# Altium project RC-XD(RX).PrjPcb
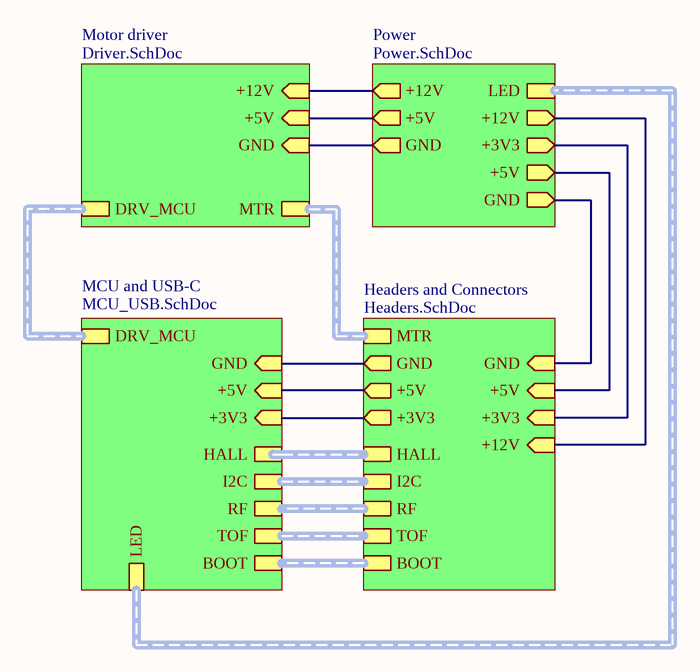
[diagram p0: Overview.SchDoc]
GlobalAddress: Tallinn; GlobalAddress2: Harju maakond; GlobalProjectRevision: v1; GlobalProjectTitle: RC-XD; GlobalProjectTitleAbr: RX_PCB; GlobalRevisionDate: 2026-1-14; GlobalRevisionEngineer: Robin Madar
3 sheets, 38 parts. Net scope: hierarchical (ports join the sheet entries above them; power ports are global).
Board file: RX.PcbDoc
Sheets:
  Overview.SchDoc
    Motor driver = Driver.SchDoc
    MCU and USB-C = MCU_USB.SchDoc

## Sheet Overview.SchDoc
size 297 x 209 mm; SheetNumber: 1; SheetTotal: 5

### Sub-sheets
Headers and Connectors = Headers.SchDoc (file not in this document): +3V3 (in), GND (in), +5V (in), MTR, +3V3 (out), +5V (out), GND (out), HALL, I2C, RF, TOF, BOOT, +12V (in)
MCU and USB-C = MCU_USB.SchDoc: +3V3 (in), GND (in), +5V (in), DRV_MCU, HALL, I2C, RF, TOF, BOOT, LED
Motor driver = Driver.SchDoc: +12V (in), +5V (in), GND (in), MTR, DRV_MCU
Power = Power.SchDoc (file not in this document): +12V (out), +3V3 (out), GND (out), GND (out), +5V (out), +5V (out), LED, +12V (out)

### Nets
(unnamed): sheet Motor driver/+12V, sheet Power/+12V
(unnamed): sheet Motor driver/+5V, sheet Power/+5V
(unnamed): sheet Motor driver/GND, sheet Power/GND
(unnamed): sheet Power/+3V3, sheet Headers and Connectors/+3V3
(unnamed): sheet Power/GND, sheet Headers and Connectors/GND
(unnamed): sheet Power/+5V, sheet Headers and Connectors/+5V
(unnamed): sheet Power/+12V, sheet Headers and Connectors/+12V
(unnamed): sheet MCU and USB-C/+3V3, sheet Headers and Connectors/+3V3
(unnamed): sheet MCU and USB-C/GND, sheet Headers and Connectors/GND
(unnamed): sheet MCU and USB-C/+5V, sheet Headers and Connectors/+5V

### Buses and harness runs
harness sheet Headers and Connectors/BOOT = sheet MCU and USB-C/BOOT
harness sheet Headers and Connectors/HALL = sheet MCU and USB-C/HALL
harness sheet Headers and Connectors/I2C = sheet MCU and USB-C/I2C
harness sheet Headers and Connectors/MTR = sheet Motor driver/MTR
harness sheet Headers and Connectors/RF = sheet MCU and USB-C/RF
harness sheet Headers and Connectors/TOF = sheet MCU and USB-C/TOF
harness sheet MCU and USB-C/DRV_MCU = sheet Motor driver/DRV_MCU
harness sheet MCU and USB-C/LED = sheet Power/LED

### Notes on the sheet
- THIS DOCUMENT AND THE DATA DISCLOSED HEREIN OR
- HEREWITH IS THE PROPERTY OF ALTIUM LIMITED AND MAY
- DWG NO:
- REVISION
- REV:
- DESCRIPTION
- DATE
- APPROVED
- BE FREELY DISTRIBUTED IN WHOLE. NO RIGHTS ARE
- RESERVED OR EXPRESS OR IMPLIED WARANTEE GIVEN.
- ENG:
- APPROVALS
- PROJECT
- DSN:
- CHK:
- REFERENCE DOCUMENTS
- PROJECT REVISION:
- TITLE
- DOCUMENT REVISION:
- DESIGN ITEM:
- BOM:
- FAB DWG:
- PCB DWG:
- ASSY DWG:
- SCALE:
- A3
- SIZE
- CAGE CODE
- FILE NAME
- DWG NO.
- SHEET
- OF
- REV

## Sheet Driver.SchDoc
size 297 x 209 mm; ENG_APP_DATE: --/--/--; DSN_APP_DATE: --/--/--; CHK_APP_DATE: --/--/--; SheetNumber: 2; SheetTotal: 5
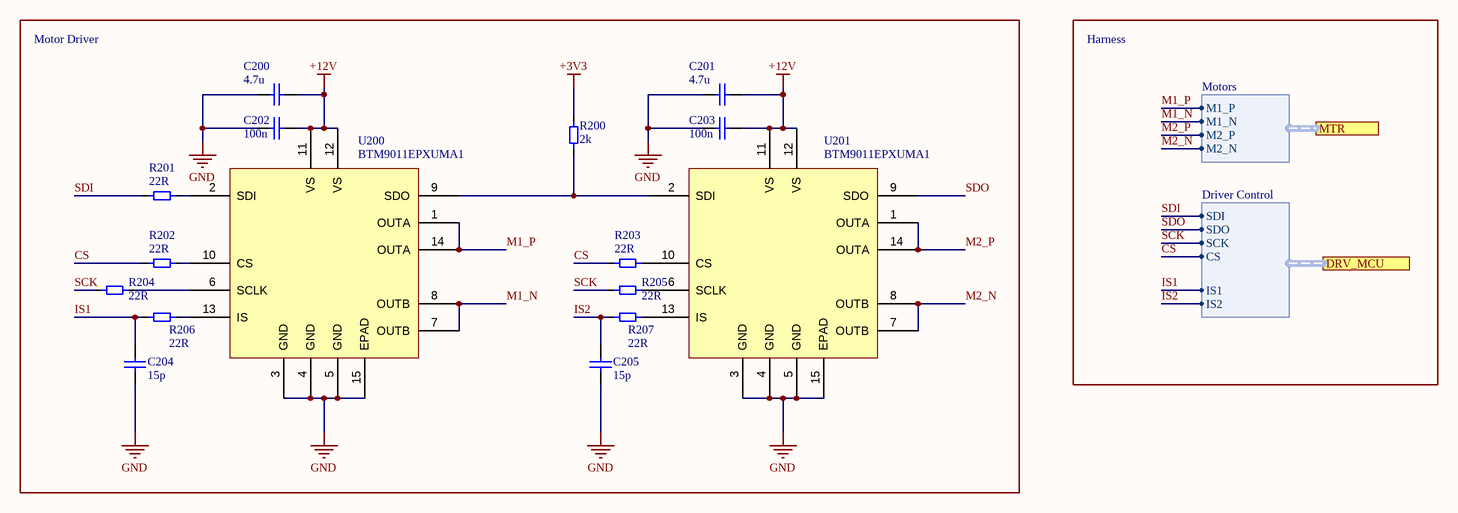
[diagram p1: Driver.SchDoc]

### Parts
C200  4.7u  [MLCC_0603_M]
C201  4.7u  [MLCC_0603_M]
C202  100n  [MLCC_0603_M]
C203  100n  [MLCC_0603_M]
C204  15p  [MLCC_0603_M]
C205  15p  [MLCC_0603_M]
R200  2k  [Resistor_0603_M]
R201  22R  [Resistor_0603_M]
R202  22R  [Resistor_0603_M]
R203  22R  [Resistor_0603_M]
R204  22R  [Resistor_0603_M]
R205  22R  [Resistor_0603_M]
R206  22R  [Resistor_0603_M]
R207  22R  [Resistor_0603_M]
U200  BTM9011EPXUMA1  [BTM9011EPXUMA1]
U201  BTM9011EPXUMA1  [BTM9011EPXUMA1]

### Blocks framed on the sheet
Motor Driver: C200-C205 R200-R207 U200 U201

### Ports
DRV_MCU (harness Driver Control, see Overview[3B], MCU_USB[2A]), MTR (harness Motors, see Overview[3B], Headers[2A])

### Harnesses
Motors: M1_P, M1_N, M2_P, M2_N
Driver Control: SCK, SDO, IS1, SDI, IS2, CS

### Nets
+3V3: R200.2
+12V: C200.2 C201.2 C202.2 C203.2 U200.11(VS) U200.12(VS) U201.11(VS) U201.12(VS)
GND: C200.1 C201.1 C202.1 C203.1 C204.2 C205.2 U200.3(GND) U200.4(GND) U200.5(GND) U200.15(EPAD) U201.3(GND) U201.4(GND) U201.5(GND) U201.15(EPAD)
CS: R202.1 R203.1 ; port DRV_MCU.CS
IS1: C204.1 R206.1 ; port DRV_MCU.IS1
IS2: C205.1 R207.1 ; port DRV_MCU.IS2
M1_N: U200.7(OUTB) U200.8(OUTB) ; port MTR.M1_N
M1_P: U200.1(OUTA) U200.14(OUTA) ; port MTR.M1_P
M2_N: U201.7(OUTB) U201.8(OUTB) ; port MTR.M2_N
M2_P: U201.1(OUTA) U201.14(OUTA) ; port MTR.M2_P
SCK: R204.1 R205.1 ; port DRV_MCU.SCK
SDI: R201.1 ; port DRV_MCU.SDI
SDO: U201.9(SDO) ; port DRV_MCU.SDO
NetR200_1: R200.1 U200.9(SDO) U201.2(SDI)
NetR201_2: R201.2 U200.2(SDI)
NetR202_2: R202.2 U200.10(CS)
NetR203_2: R203.2 U201.10(CS)
NetR204_2: R204.2 U200.6(SCLK)
NetR205_2: R205.2 U201.6(SCLK)
NetR206_2: R206.2 U200.13(IS)
NetR207_2: R207.2 U201.13(IS)

### Notes on the sheet
- Harness
- THIS DOCUMENT AND THE DATA DISCLOSED HEREIN OR
- HEREWITH IS THE PROPERTY OF ALTIUM LIMITED AND MAY
- DWG NO:
- REVISION
- REV:
- DESCRIPTION
- DATE
- APPROVED
- BE FREELY DISTRIBUTED IN WHOLE. NO RIGHTS ARE
- RESERVED OR EXPRESS OR IMPLIED WARANTEE GIVEN.
- ENG:
- APPROVALS
- PROJECT
- DSN:
- CHK:
- REFERENCE DOCUMENTS
- PROJECT REVISION:
- TITLE
- DOCUMENT REVISION:
- DESIGN ITEM:
- BOM:
- FAB DWG:
- PCB DWG:
- ASSY DWG:
- SCALE:
- A3
- SIZE
- CAGE CODE
- FILE NAME
- DWG NO.
- SHEET
- OF
- REV

### Library data of the parts
C200 C201 = CMP-001-1257-1: MLCC, 0603, 4.7u, 10%, 35V, X5R; Manufacturer: Any; Value: 4,7µF; Capacitor Type: Ceramic; Dielectric: X5R; Tolerance: 10%; Voltage: 35V; Part number: MLCC, 0603, 4.7u, 10%, 35V, X5R; Case/Package: 0603; Mount: SMD; RoHS: Yes
C202 C203 = CMP-001-0755-1: MLCC, 0603, 100n, 10%, 35V, X7R; Manufacturer: Any; Capacitor Type: Ceramic; Value: 100nF; Voltage: 35V; Case/Package: 0603; Part number: MLCC, 0603, 100n, 10%, 35V, X7R; RoHS: Yes; Tolerance: 10%; Dielectric: X7R; Mount: SMD
C204 C205 = CMP-001-0474-1: MLCC, 0603, 15p, 5%, 50V, C0G/NP0; Manufacturer: Any; Value: 15pF; Capacitor Type: Ceramic; Dielectric: C0G/NP0; Case/Package: 0603; Part number: MLCC, 0603, 15p, 5%, 50V, C0G/NP0; Voltage: 50V; Mount: SMD; RoHS: Yes; Tolerance: 5%
R200 = CMP-001-0084-2: Resistor, 0603, 2k, 1%, 1/10W; Manufacturer: Any; Power: 100mW; Mount: SMD; Value: 2k; RoHS: Yes; Case/Package: 0603; Part number: Resistor, 0603, 2k, 1%, 1/10W; Tolerance: 1%
R201-R207 = CMP-001-0038-3: Resistor, 0603, 22R, 1%, 1/10W; Manufacturer: Any; Value: 22; Power: 100mW; Part number: Resistor, 0603, 22R, 1%, 1/10W; Tolerance: 1%; Case/Package: 0603; Mount: SMD; RoHS: Yes
U200 U201 = CMP-00022-3: DC Mtr Drive, Brush, 150DEGC, TSSOPEP-14 Rohs Compliant: Yes; Manufacturer: Infineon Technologies; Current - Output: 9.2A; Voltage - Supply: 4.5V ~ 40V; Interface: SPI; Output configuration: Full bridge; Motor Type - AC, DC: Brushed DC; REACH SVHC: Yes; RoHS: Compliant; Voltage - Load: 4.5V ~ 40V; Operating Temperature: -40C ~ 150C; Case/Package: 14-TSSOP; Mount: SMD; Part number: BTM9011EPXUMA1

## Sheet MCU_USB.SchDoc
size 297 x 209 mm; SheetNumber: 4; SheetTotal: 5
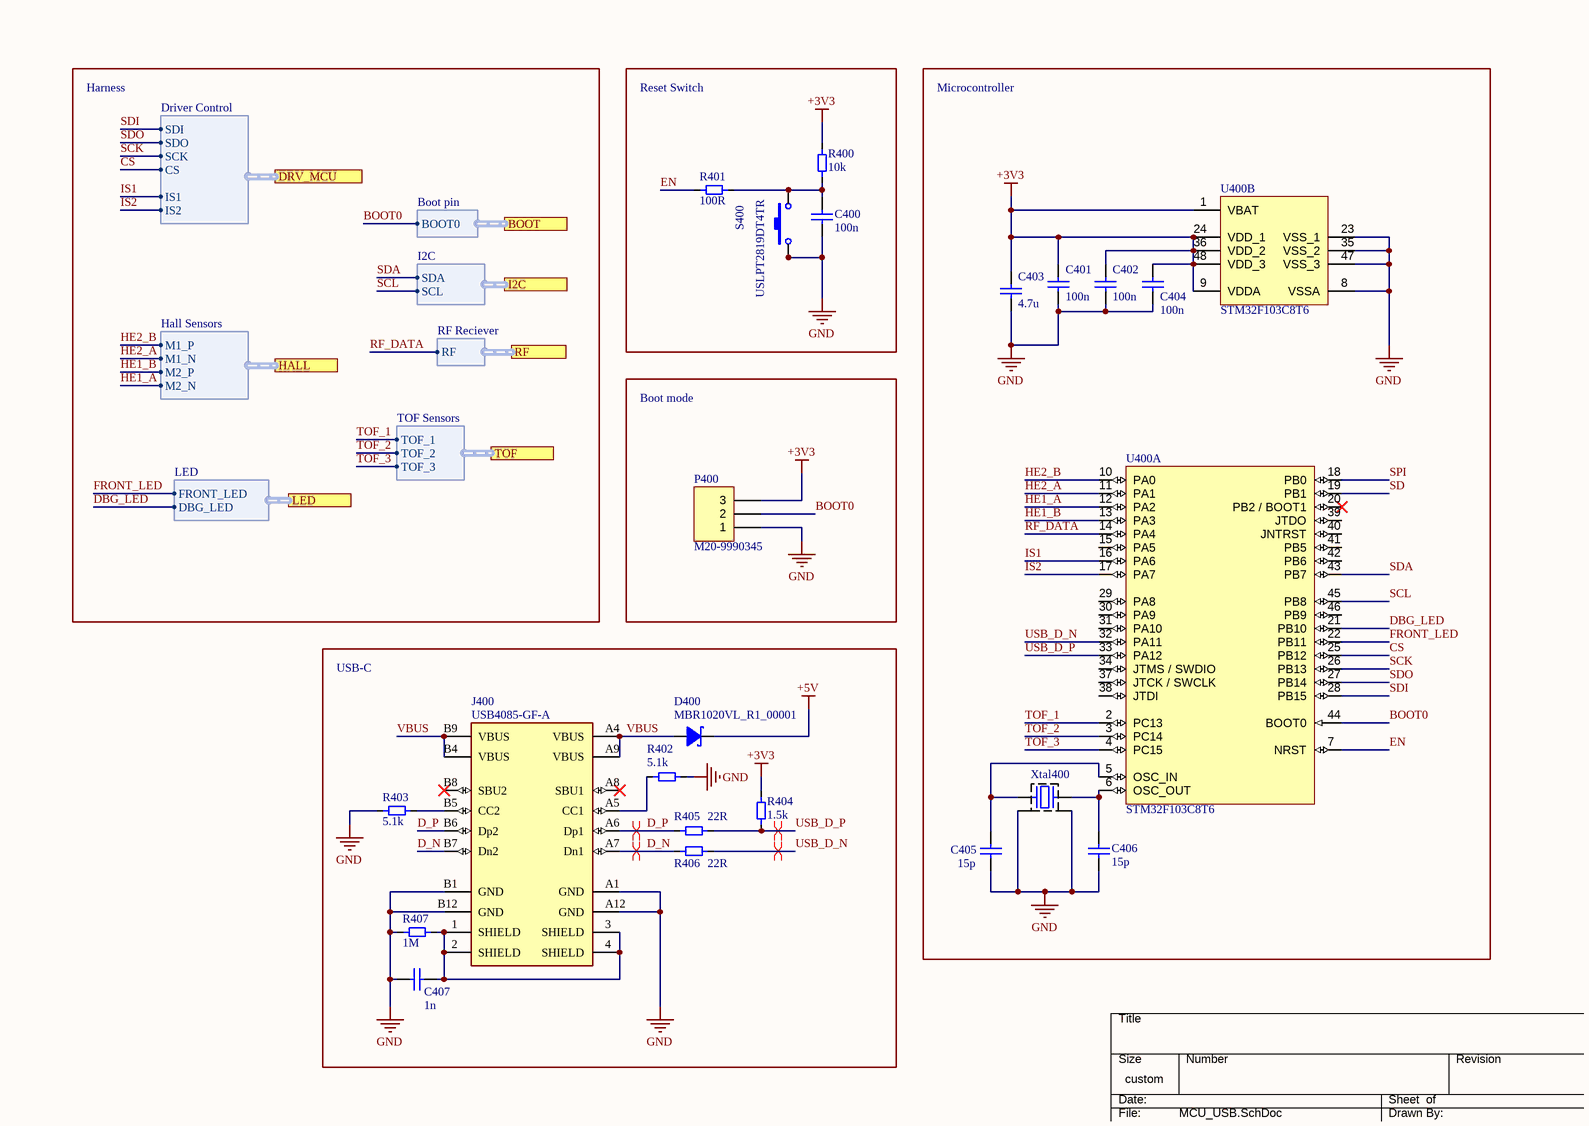
[diagram p2: MCU_USB.SchDoc]

### Parts
C400  100n  [MLCC_0603_M]
C401  100n  [MLCC_0603_M]
C402  100n  [MLCC_0603_M]
C403  4.7u  [MLCC_0805_M]
C404  100n  [MLCC_0603_M]
C405  15p  [MLCC_0402_M]
C406  15p  [MLCC_0402_M]
C407  1n  [MLCC_0603_M]
D400  MBR1020VL_R1_00001  [FP-MBR1020VL_R1_00001-MFG]
J400  USB4085-GF-A  [FP-USB4085-GF-A-MFG]
P400  M20-9990345  [3Pos Pin Header]
R400  10k  [Resistor_0603_M]
R401  100R  [Resistor_0603_M]
R402  5.1k  [Resistor_0603_M]
R403  5.1k  [Resistor_0603_M]
R404  1.5k  [Resistor_0603_M]
R405  22R  [Resistor_0603_M]
R406  22R  [Resistor_0603_M]
R407  1M  [Resistor_1206_M]
S400  USLPT2819DT4TR  [USLPT2819DT4TR-Footprint-1]
U400  STM32F103C8T6  [STM-LQFP48_M]  (parts A,B of 2)
Xtal400  ABM11-16.000MHZ-12-N1G-T  [FP-ABM11-MFG]  (value not drawn)

### Blocks framed on the sheet
Reset Switch: C400 R400 R401 S400
Microcontroller: C401-C406 U400 Xtal400
Boot mode: P400
USB-C: C407 D400 J400 R402-R407

### Ports
BOOT (harness Boot pin, see Overview[3C], Headers[4A]), DRV_MCU (harness Driver Control, see Overview[3B], Driver[6B]), HALL (harness Hall Sensors, see Overview[3C], Headers[2A]), I2C (harness I2C, see Overview[3C], Headers[3A]), LED (harness LED, see Overview[3C], Power[2A]), RF (harness RF Reciever, see Overview[3C], Headers[4A]), TOF (harness TOF Sensors, see Overview[3C], Headers[3A])

### Harnesses
Driver Control: SCK, SDO, IS1, SDI, IS2, CS
Hall Sensors: M1_P, M1_N, M2_P, M2_N
LED: FRONT_LED, DBG_LED
Boot pin: BOOT0
I2C: SDA, SCL
TOF Sensors: TOF_1, TOF_2, TOF_3
RF Reciever: RF

### Nets
+3V3: C401.1 C402.1 C403.2 C404.1 P400.3 R400.2 R404.2 U400.1(VBAT) U400.9(VDDA) U400.24(VDD_1) U400.36(VDD_2) U400.48(VDD_3)
+5V: D400.1(C)
GND: C400.1 C401.2 C402.2 C403.1 C404.2 C405.1 C406.1 C407.1 J400.A1(GND) J400.A12(GND) J400.B1(GND) J400.B12(GND) P400.1 R402.2 R403.1 R407.2 S400.1 S400.2 U400.8(VSSA) U400.23(VSS_1) U400.35(VSS_2) U400.47(VSS_3) Xtal400.2 Xtal400.4
BOOT0: P400.2 U400.44(BOOT0) ; port BOOT.BOOT0
CS: U400.25(PB12) ; port DRV_MCU.CS
D_N: J400.A7(Dn1) J400.B7(Dn2) R406.1
D_P: J400.A6(Dp1) J400.B6(Dp2) R405.1
DBG_LED: U400.21(PB10) ; port LED.DBG_LED
EN: R401.2 U400.7(NRST)
FRONT_LED: U400.22(PB11) ; port LED.FRONT_LED
HE1_A: U400.12(PA2) ; port HALL.M2_N
HE1_B: U400.13(PA3) ; port HALL.M2_P
HE2_A: U400.11(PA1) ; port HALL.M1_N
HE2_B: U400.10(PA0) ; port HALL.M1_P
IS1: U400.16(PA6) ; port DRV_MCU.IS1
IS2: U400.17(PA7) ; port DRV_MCU.IS2
RF_DATA: U400.14(PA4) ; port RF.RF
SCK: U400.26(PB13) ; port DRV_MCU.SCK
SCL: U400.45(PB8) ; port I2C.SCL
SD: U400.19(PB1)
SDA: U400.43(PB7) ; port I2C.SDA
SDI: U400.28(PB15) ; port DRV_MCU.SDI
SDO: U400.27(PB14) ; port DRV_MCU.SDO
SPI: U400.18(PB0)
TOF_1: U400.2(PC13) ; port TOF.TOF_1
TOF_2: U400.3(PC14) ; port TOF.TOF_2
TOF_3: U400.4(PC15) ; port TOF.TOF_3
USB_D_N: R406.2 U400.32(PA11)
USB_D_P: R404.1 R405.2 U400.33(PA12)
VBUS: D400.2(A) J400.A4(VBUS) J400.A9(VBUS) J400.B4(VBUS) J400.B9(VBUS)
NetC400_2: C400.2 R400.1 R401.1 S400.3 S400.4
NetC405_2: C405.2 U400.5(OSC_IN) Xtal400.1
NetC406_2: C406.2 U400.6(OSC_OUT) Xtal400.3
NetC407_2: C407.2 J400.1(SHIELD) J400.2(SHIELD) J400.3(SHIELD) J400.4(SHIELD) R407.1
NetJ400_A5: J400.A5(CC1) R402.1
NetJ400_B5: J400.B5(CC2) R403.2

Not connected (* = marked no-connect by the designer): J400 A8(SBU1)* B8(SBU2)*; U400 15(PA5) 20(PB2_/_BOOT1)* 29(PA8) 30(PA9) 31(PA10) 34(JTMS_/_SWDIO) 37(JTCK_/_SWCLK) 38(JTDI) 39(JTDO) 40(JNTRST) 41(PB5) 42(PB6) 46(PB9)

### Layout directives
differential pair: D_N, D_P, USB_D_N, USB_D_P

### Notes on the sheet
- Harness
- THIS DOCUMENT AND THE DATA DISCLOSED HEREIN OR
- HEREWITH IS THE PROPERTY OF ALTIUM LIMITED AND MAY
- DWG NO:
- REVISION
- REV:
- DESCRIPTION
- DATE
- APPROVED
- BE FREELY DISTRIBUTED IN WHOLE. NO RIGHTS ARE
- RESERVED OR EXPRESS OR IMPLIED WARANTEE GIVEN.
- ENG:
- APPROVALS
- PROJECT
- DSN:
- CHK:
- REFERENCE DOCUMENTS
- PROJECT REVISION:
- TITLE
- DOCUMENT REVISION:
- DESIGN ITEM:
- BOM:
- FAB DWG:
- PCB DWG:
- ASSY DWG:
- SCALE:
- A3
- SIZE
- CAGE CODE
- FILE NAME
- DWG NO.
- SHEET
- OF
- REV

### Library data of the parts
C400-C402 C404 = CMP-001-0815-1: MLCC, 0603, 100n, 10%, 50V, X7R; Manufacturer: Any; Value: 100nF; Capacitor Type: Ceramic; Part number: MLCC, 0603, 100n, 10%, 50V, X7R; RoHS: Yes; Dielectric: X7R; Mount: SMD; Voltage: 50V; Tolerance: 10%; Case/Package: 0603
C403 = CMP-001-1830-1: MLCC, 0805, 4.7u, 20%, 50V, X5R; Manufacturer: Any; Capacitor Type: Ceramic; Value: 4.7µF; Mount: SMD; Case/Package: 0805; Dielectric: X5R; RoHS: Yes; Part number: MLCC, 0805, 4.7u, 20%, 50V, X5R; Voltage: 50V; Tolerance: 20%
C405 C406 = CMP-001-1853-1: MLCC, 0402, 15p, 10%, 25V, C0G/NP0; Manufacturer: Any; Capacitor Type: Ceramic; Voltage Rating: 25; Value: 15pF; Dielectric: C0G; Temperature Coefficient: 300ppm/°C; Height: 0.5mm; Width: 0.02inch; Contact Plating: Tin; Package Quantity: 1; Case/Package: 0402; Depth: 0.5mm; Material: Ceramic; Packaging: Tape and Reel; Radiation Hardening: No; Case Code (Imperial): 0402; Min Operating Temperature: -55°C; Mount: Surface Mount; RoHS: Yes; Length: 1mm; Thickness: 0.022inch; Part number: MLCC, 0402, 15p, 10%, 25V, C0G/NP0; Capacitance: 15pF; Tolerance: 10%; Case Code (Metric): 1005; Voltage: 25V; Max Operating Temperature: 125°C
C407 = CMP-001-0547-1: MLCC, 0603, 1n, 10%, 50V, X5R; Manufacturer: Any; Capacitor Type: Ceramic; Value: 1nF; Case/Package: 0603; Part number: MLCC, 0603, 1n, 10%, 50V, X5R; RoHS: Yes; Dielectric: X5R; Mount: SMD; Tolerance: 10%; Voltage: 50V
D400 = CMP-ROOT-01310-1: Rectifier Diode, Schottky, 1 Phase, 1 Element, 1A, 20V V(RRM), Silicon; Manufacturer: Panjit; Max Forward Surge Current (Ifsm): 45A; Max Junction Temperature (Tj): 125°C; Number of Elements: 1; Peak Reverse Current: 600µA; Case/Package: SOD-123FL; Mount: SMD; Part number: MBR1020VL_R1_00001; Pins: 2; RoHS: Compliant; Forward Current: 1A; Height: 1.1mm; Lifecycle Status: Production; Max Operating Temperature: 125°C; Max Output current: 1A; Max Repetitive Reverse Voltage (Vrrm): 20V; Min Operating Temperature: -55°C; Number of Terminals: 2; REACH SVHC: No; Reverse Standoff Voltage: 20V
J400 = CMP-001-1800-1: USB Connector, 16 Contact(s), Female, Right Angle, Solder Terminal, Locking, Receptacle; Manufacturer: GCT; Part number: USB4800-03-A; USB Standard: USB 2.0; Standoff Height: 3.5mm; USB PD: 3.2; Current Rating: 4.25A; Mating Cycles: 10000; Number of Contacts: 16; Number of Ports: 1; Shielding: Shielded; Voltage Rating: 20V; RoHS: Yes; Pins: 16; Mount: TH; Connector Type: USB; Contact Material: Copper Alloy; Contact Plating: Gold; Flammability Rating: UL94 V-0; Gender: Receptacle; Height: 3.66mm; Insulation Color: Black; Max Operating Temperature: 85°C; Min Operating Temperature: -40°C; Mounting Technology: Through Hole,Horizontal; Number of Positions: 16; Orientation: Right Angle; Packaging: Tape and Reel; Series: USB4085; Termination: Solder
P400 = CMP-ROOT-00217-1: Connector Header Through Hole 3 position 0.100" (2.54mm); Manufacturer: Harwin Inc.; Insulation Resistance: 10GR; Number of Positions: 3; Voltage Rating (AC): 750V; Max Current Rating: 3A; Contact Resistance: 25mR; Connector Type: Male Pin; Min Operating Temperature: -40°C; Contact Material: Brass,Bronze; Package Quantity: 1000; Housing Material: Nylon; Contact Plating: Gold; Contact Mating Length: 0.24inch; Pitch: 2.54mm; Number of Rows: 1; REACH SVHC: No SVHC; Packaging: Bulk; Housing Color: Black; Width: 0.25inch; Number of Contacts: 3; Pins: 3; Mount: Through Hole; Radiation Hardening: No; RoHS: Yes; Weight: 0.006138oz; Depth: 2.54mm; Color: Black; Part number: M20-9990345; Case/Package: SIL; Termination: Solder; Max Operating Temperature: 105°C; Current Rating: 3A; Length: 7.62mm; Height: 0.125inch; Orientation: Straight
R400 = CMP-001-0101-2: Resistor, 0603, 10k, 1%, 1/10W; Manufacturer: Any; Power: 100mW; Tolerance: 1%; Value: 10k; RoHS: Yes; Mount: SMD; Case/Package: 0603; Part number: Resistor, 0603, 10k, 1%, 1/10W
R401 = CMP-001-0054-5: Resistor, 0603, 100R, 1%, 1/10W; Manufacturer: Any; Value: 100; Power: 100mW; Case/Package: 0603; Mount: SMD; Part number: Resistor, 0603, 100R, 1%, 1/10W; Tolerance: 1%; RoHS: Yes
R402 R403 = CMP-001-0094-2: Resistor, 0603, 5.1k, 1%, 1/10W; Manufacturer: Any; Power: 100mW; Value: 5,1k; Case/Package: 0603; Part number: Resistor, 0603, 5.1k, 1%, 1/10W; Mount: SMD; Tolerance: 1%; RoHS: Yes
R404 = CMP-001-0081-2: Resistor, 0603, 1.5k, 1%, 1/10W; Manufacturer: Any; Power: 100mW; Value: 1,5k; Case/Package: 0603; Mount: SMD; RoHS: Yes; Part number: Resistor, 0603, 1.5k, 1%, 1/10W; Tolerance: 1%
R405 R406 = CMP-001-0038-3: as R201 on sheet Driver; Part number: Resistor, 0603, 22R, 1%, 1/10W; Tolerance: 1%; Case/Package: 0603; Mount: SMD; RoHS: Yes
R407 = CMP-0001-00051-1: Resistor, 1206, 1M, 1%, 1/4W; Manufacturer: Any; Case/Package: 1206; RoHS: Yes; Value: 1M; Mount: SMD; Part number: Any
S400 = CMP-ROOT-01290-1: Keypad Switch, SPST, 0.05A, 1.96N, Solder Terminal, Panel Mount; Manufacturer: TE Connectivity ALCOSWITCH Switches; Contact Current Rating: 50mA; Case/Package: Non-standard; Mount: SMD; Part number: USLPT2819DT4TR; RoHS: Compliant; China RoHS: Compliant; Color: Black; Contact Material: Stainless Steel; Contact Plating: Silver; Housing Material: Polyethylene; Lifecycle Status: Production; Max Current Rating: 50mA; Max Operating Temperature: 85°C; Min Operating Temperature: -40°C; Operating Force: 1.96N; Packaging: Tape & Reel; REACH SVHC: Yes; Throw Configuration: SPST
U400 = CMP-00012-2: MCU 32-bit STM32F1 ARM Cortex M3 RISC 64KB Flash 2.5V/3.3V 48-Pin LQFP Tray; Manufacturer: STMicroelectronics; Manufacturer Package Identifier: ai14911d; Address Bus Width: 32b; Frequency: 72MHz; Interface: CAN, USB; Clock Frequency: 16MHz; Max Power Dissipation: 363mW; Max Supply Current: 50mA; Max Supply Voltage: 3.6V; Min Supply Voltage: 2V; Nominal Supply Current: 1.7µA; Number of A/D Converters: 2; Number of ADC Channels: 10; Number of I/Os: 37; Number of Programmable I/O: 48; Number of Timers/Counters: 4; Number of USART Channels: 3; Operating Supply Voltage: 3.3V; Oscillator Type: Internal; Peripherals: POR; RAM Size: 20kB; Watchdog Timer: Yes; ADC Channels (Resolution): 10-Ch 12-Bit; Density: 512kb; EEPROM Memory Size: 0B; Number of Bits: 32; Number of Interrupts: 16; Number of PWM Channels: 1; Case/Package: LQFP; China RoHS: Compliant; Core Architecture: ARM; Data Bus Width: 32b; Flash Memory Size: 64kB; Height: 1.45mm; Lead Free: Lead Free; Length: 7mm; Lifecycle Status: Production; Max Operating Temperature: 85°C; Memory Size: 64kB; Memory Format: FLASH; Min Operating Temperature: -40°C; Number of Channels: 10; Number of I2C Channels: 2; Pins: 48; Number of SPI Channels: 2; Number of Terminals: 48; REACH SVHC: Yes; Radiation Hardening: No; RoHS: Compliant; Schedule B: 8542310000; Terminal Pitch: 500µm; Width: 7mm; Mount: SMD; Part number: STM32F103C8T6; Height - Seated (Max): 1.6mm; Mounting Technology: Surface Mount; Termination: SMD/SMT
Xtal400 = CMP-ROOT-01254-3: Crystal 16MHz ±10ppm (Tol) ±15ppm (Stability) 12pF FUND 150Ohm 4-Pin Ultra Mini-CSMD T/R; Manufacturer: Abracon LLC; ESR (Equivalent Series Resistance): 150Ω; Frequency Tolerance: 0.001%; Case/Package: 4-SMD, No Lead; Mount: SMD; RoHS: Compliant; China RoHS: Compliant; Frequency: 16MHz; Frequency Stability: 15ppm; Height: 590µm; Length: 2mm; Lifecycle Status: Production; Load Capacitance: 12pF; Max Operating Temperature: 85°C; Min Operating Temperature: -30°C; Mounting Technology: Surface Mount; REACH SVHC: Yes; Schedule B: 8541600080; ESR: 150Ω; Tolerance: 0.001%; Width: 1.6mm

## Nets that join several sheets
+3V3: Driver (R200.2), MCU_USB (12 pins)
GND: Driver (14 pins), MCU_USB (24 pins)
CS: Driver (R202.1 R203.1), MCU_USB (U400.25)
IS1: Driver (C204.1 R206.1), MCU_USB (U400.16)
IS2: Driver (C205.1 R207.1), MCU_USB (U400.17)
SCK: Driver (R204.1 R205.1), MCU_USB (U400.26)
SDI: Driver (R201.1), MCU_USB (U400.28)
SDO: Driver (U201.9), MCU_USB (U400.27)